# Altium schematic sheet ZIF_to_DSUB25.SchDoc
size 368 x 215 mm
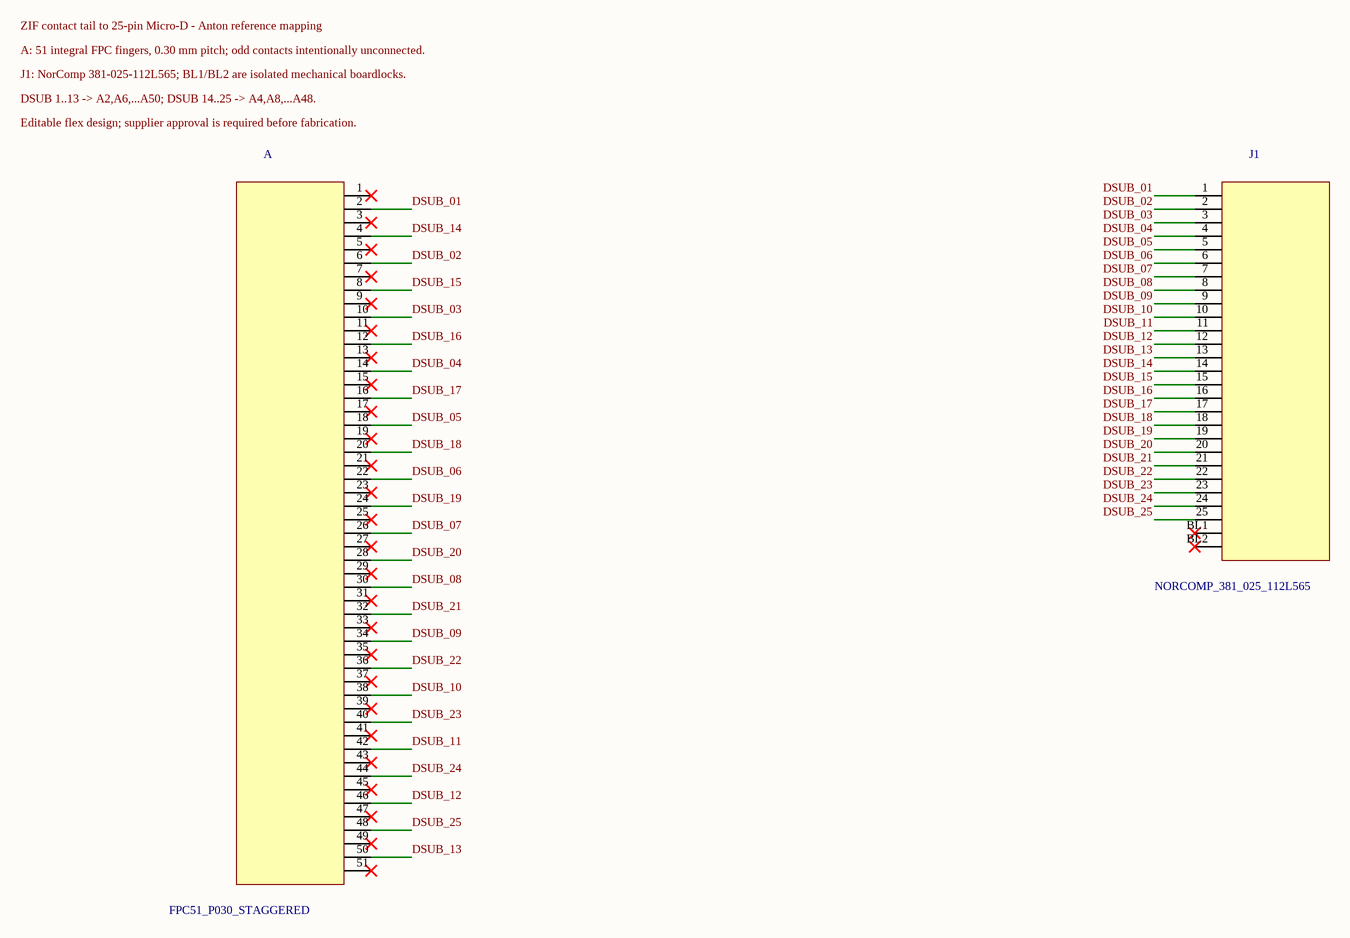
[diagram p0: ZIF_to_DSUB25.SchDoc]

## Parts
A  FPC51_P030_STAGGERED  [FPC51_P030_STAGGERED]
J1  NORCOMP_381_025_112L565  [NORCOMP_381_025_112L565]

## Nets
DSUB_01: A.2 J1.1
DSUB_02: A.6 J1.2
DSUB_03: A.10 J1.3
DSUB_04: A.14 J1.4
DSUB_05: A.18 J1.5
DSUB_06: A.22 J1.6
DSUB_07: A.26 J1.7
DSUB_08: A.30 J1.8
DSUB_09: A.34 J1.9
DSUB_10: A.38 J1.10
DSUB_11: A.42 J1.11
DSUB_12: A.46 J1.12
DSUB_13: A.50 J1.13
DSUB_14: A.4 J1.14
DSUB_15: A.8 J1.15
DSUB_16: A.12 J1.16
DSUB_17: A.16 J1.17
DSUB_18: A.20 J1.18
DSUB_19: A.24 J1.19
DSUB_20: A.28 J1.20
DSUB_21: A.32 J1.21
DSUB_22: A.36 J1.22
DSUB_23: A.40 J1.23
DSUB_24: A.44 J1.24
DSUB_25: A.48 J1.25

Not connected (* = marked no-connect by the designer): A 1* 3* 5* 7* 9* 11* 13* 15* 17* 19* 21* 23* 25* 27* 29* 31* 33* 35* 37* 39* 41* 43* 45* 47* 49* 51*; J1 BL1* BL2*

## Notes on the sheet
- ZIF contact tail to 25-pin Micro-D - Anton reference mapping
- A: 51 integral FPC fingers, 0.30 mm pitch; odd contacts intentionally unconnected.
- J1: NorComp 381-025-112L565; BL1/BL2 are isolated mechanical boardlocks.
- DSUB 1..13 -> A2,A6,...A50; DSUB 14..25 -> A4,A8,...A48.
- Editable flex design; supplier approval is required before fabrication.

## Library data of the parts
A = FPC51_P030_STAGGERED: Integral FPC contact array
J1 = NORCOMP_381_025_112L565: NorComp 381-025-112L565, 25 signal pins and two boardlocks